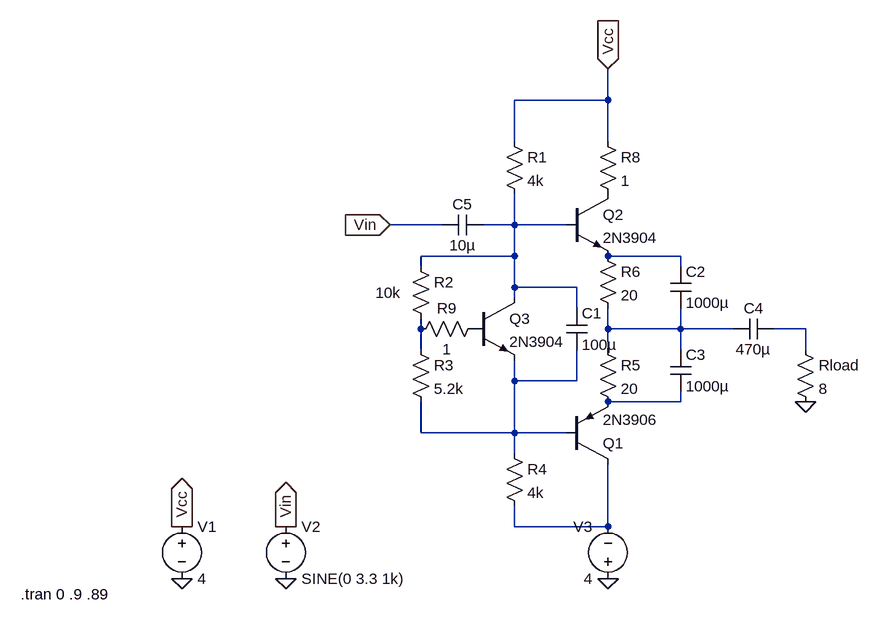
[diagram p0: schematic 411SoundControlAB.asc]
411SoundControlAB.asc, the LTspice schematic file:
Version 4
SHEET 1 1016 680
WIRE 624 -208 624 -256
WIRE 624 -208 480 -208
WIRE 480 -144 480 -208
WIRE 624 -144 624 -208
WIRE 368 -16 288 -16
WIRE 480 -16 480 -64
WIRE 480 -16 432 -16
WIRE 560 -16 480 -16
WIRE 480 32 480 -16
WIRE 480 32 336 32
WIRE 736 32 624 32
WIRE 336 48 336 32
WIRE 736 48 736 32
WIRE 480 80 480 32
WIRE 576 80 480 80
WIRE 480 96 480 80
WIRE 576 112 576 80
WIRE 336 144 336 128
WIRE 624 144 624 112
WIRE 736 144 736 112
WIRE 736 144 624 144
WIRE 816 144 736 144
WIRE 928 144 880 144
WIRE 336 176 336 144
WIRE 624 176 624 144
WIRE 736 176 736 144
WIRE 928 176 928 144
WIRE 480 224 480 192
WIRE 576 224 576 176
WIRE 576 224 480 224
WIRE 736 256 736 240
WIRE 736 256 624 256
WIRE 336 304 336 256
WIRE 480 304 480 224
WIRE 480 304 336 304
WIRE 560 304 480 304
WIRE 480 336 480 304
WIRE 480 448 480 416
WIRE 624 448 624 352
WIRE 624 448 480 448
FLAG 928 256 0
FLAG -32 528 0
FLAG 128 528 0
FLAG -32 448 Vcc
IOPIN -32 448 Out
FLAG 624 -256 Vcc
IOPIN 624 -256 In
FLAG 128 448 Vin
IOPIN 128 448 Out
FLAG 288 -16 Vin
IOPIN 288 -16 In
FLAG 624 528 0
SYMBOL res 464 -160 R0
SYMATTR InstName R1
SYMATTR Value 4k
SYMBOL res 320 32 R0
WINDOW 3 -54 56 Left 2
SYMATTR Value 10k
SYMATTR InstName R2
SYMBOL res 320 160 R0
SYMATTR InstName R3
SYMATTR Value 5.2k
SYMBOL npn 560 -64 R0
SYMATTR InstName Q2
SYMATTR Value 2N3904
SYMBOL res 608 160 R0
SYMATTR InstName R5
SYMATTR Value 20
SYMBOL res 608 16 R0
SYMATTR InstName R6
SYMATTR Value 20
SYMBOL res 912 160 R0
SYMATTR InstName Rload
SYMATTR Value 8
SYMBOL voltage -32 432 R0
WINDOW 123 0 0 Left 0
WINDOW 39 0 0 Left 0
SYMATTR InstName V1
SYMATTR Value 4
SYMBOL voltage 128 432 R0
WINDOW 123 24 124 Left 2
WINDOW 39 24 152 Left 2
SYMATTR InstName V2
SYMATTR Value SINE(0 3.3 1k)
SYMBOL pnp 560 352 M180
SYMATTR InstName Q1
SYMATTR Value 2N3906
SYMBOL res 464 320 R0
SYMATTR InstName R4
SYMATTR Value 4k
SYMBOL cap 560 112 R0
SYMATTR InstName C1
SYMATTR Value 100µ
SYMBOL cap 720 48 R0
SYMATTR InstName C2
SYMATTR Value 1000µ
SYMBOL cap 720 176 R0
SYMATTR InstName C3
SYMATTR Value 1000µ
SYMBOL res 608 -160 R0
SYMATTR InstName R8
SYMATTR Value 1
SYMBOL res 320 160 R270
WINDOW 0 32 56 VTop 2
WINDOW 3 0 56 VBottom 2
SYMATTR InstName R9
SYMATTR Value 1
SYMBOL npn 416 96 R0
SYMATTR InstName Q3
SYMATTR Value 2N3904
SYMBOL cap 880 128 R90
WINDOW 0 0 32 VBottom 2
WINDOW 3 32 32 VTop 2
SYMATTR InstName C4
SYMATTR Value 470µ
SYMBOL cap 432 -32 R90
WINDOW 0 0 32 VBottom 2
WINDOW 3 32 32 VTop 2
SYMATTR InstName C5
SYMATTR Value 10µ
SYMBOL voltage 624 544 R180
WINDOW 0 24 96 Left 2
WINDOW 3 24 16 Left 2
SYMATTR InstName V3
SYMATTR Value 4
TEXT -280 552 Left 2 !.tran 0 .9 .89

The netlist it stands for:
* 411SoundControlAB.asc
R1 Vcc N001 4k
R2 N001 N003 10k
R3 N003 N006 5.2k
Q2 P001 N001 N002 0 2N3904
R5 N004 N007 20
R6 N002 N004 20
Rload N005 0 8
V1 Vcc 0 4
V2 Vin 0 SINE(0 3.3 1k)
Q1 N008 N006 N007 0 2N3906
R4 N006 N008 4k
C1 N001 N006 100µ
C2 N002 N004 1000µ
C3 N004 N007 1000µ
R8 Vcc P001 1
R9 N003 P002 1
Q3 N001 P002 N006 0 2N3904
C4 N005 N004 470µ
C5 N001 Vin 10µ
V3 0 N008 4
.model NPN NPN
.model PNP PNP
.lib standard.bjt
.tran 0 .9 .89
.backanno
.end